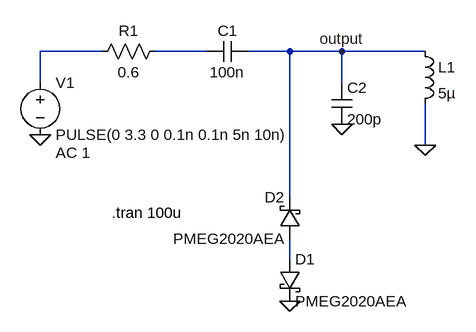
[diagram p0: schematic input_esd.asc]
input_esd.asc, the LTspice schematic file:
Version 4
SHEET 1 880 680
WIRE -144 32 -240 32
WIRE 16 32 -64 32
WIRE 144 32 80 32
WIRE 224 32 144 32
WIRE 352 32 224 32
WIRE -240 80 -240 32
WIRE 224 80 224 32
WIRE 352 176 352 112
WIRE 144 256 144 32
WIRE 144 352 144 320
FLAG 224 144 0
FLAG -240 160 0
FLAG 224 32 output
FLAG 352 176 0
FLAG 144 416 0
SYMBOL voltage -240 64 R0
WINDOW 123 24 124 Left 2
WINDOW 39 0 0 Left 2
SYMATTR InstName V1
SYMATTR Value PULSE(0 3.3 0 0.1n 0.1n 5n 10n)
SYMATTR Value2 AC 1
SYMBOL cap 208 80 R0
SYMATTR InstName C2
SYMATTR Value 200p
SYMBOL res -48 16 R90
WINDOW 0 0 56 VBottom 2
WINDOW 3 32 56 VTop 2
SYMATTR InstName R1
SYMATTR Value 0.6
SYMBOL cap 80 16 R90
WINDOW 0 0 32 VBottom 2
WINDOW 3 32 32 VTop 2
SYMATTR InstName C1
SYMATTR Value 100n
SYMBOL ind 336 16 R0
SYMATTR InstName L1
SYMATTR Value 5µ
SYMATTR SpiceLine Rser=0.08
SYMBOL schottky 128 352 R0
SYMATTR InstName D1
SYMATTR Value PMEG2020AEA
SYMATTR Description Diode
SYMATTR Type diode
SYMBOL schottky 160 320 R180
WINDOW 0 24 64 Left 2
WINDOW 3 24 0 Left 2
SYMATTR InstName D2
SYMATTR Value PMEG2020AEA
SYMATTR Description Diode
SYMATTR Type diode
TEXT -130 280 Left 2 !.tran 100u

The netlist it stands for:
* input_esd.asc
V1 N001 0 PULSE(0 3.3 0 0.1n 0.1n 5n 10n) AC 1
C2 output 0 200p
R1 N002 N001 0.6
C1 output N002 100n
L1 output 0 5µ Rser=0.08
D1 N003 0 PMEG2020AEA
D2 N003 output PMEG2020AEA
.model D D
.lib standard.dio
.tran 100u
.backanno
.end